# Altium schematic sheet LCL.schdoc
size Letter
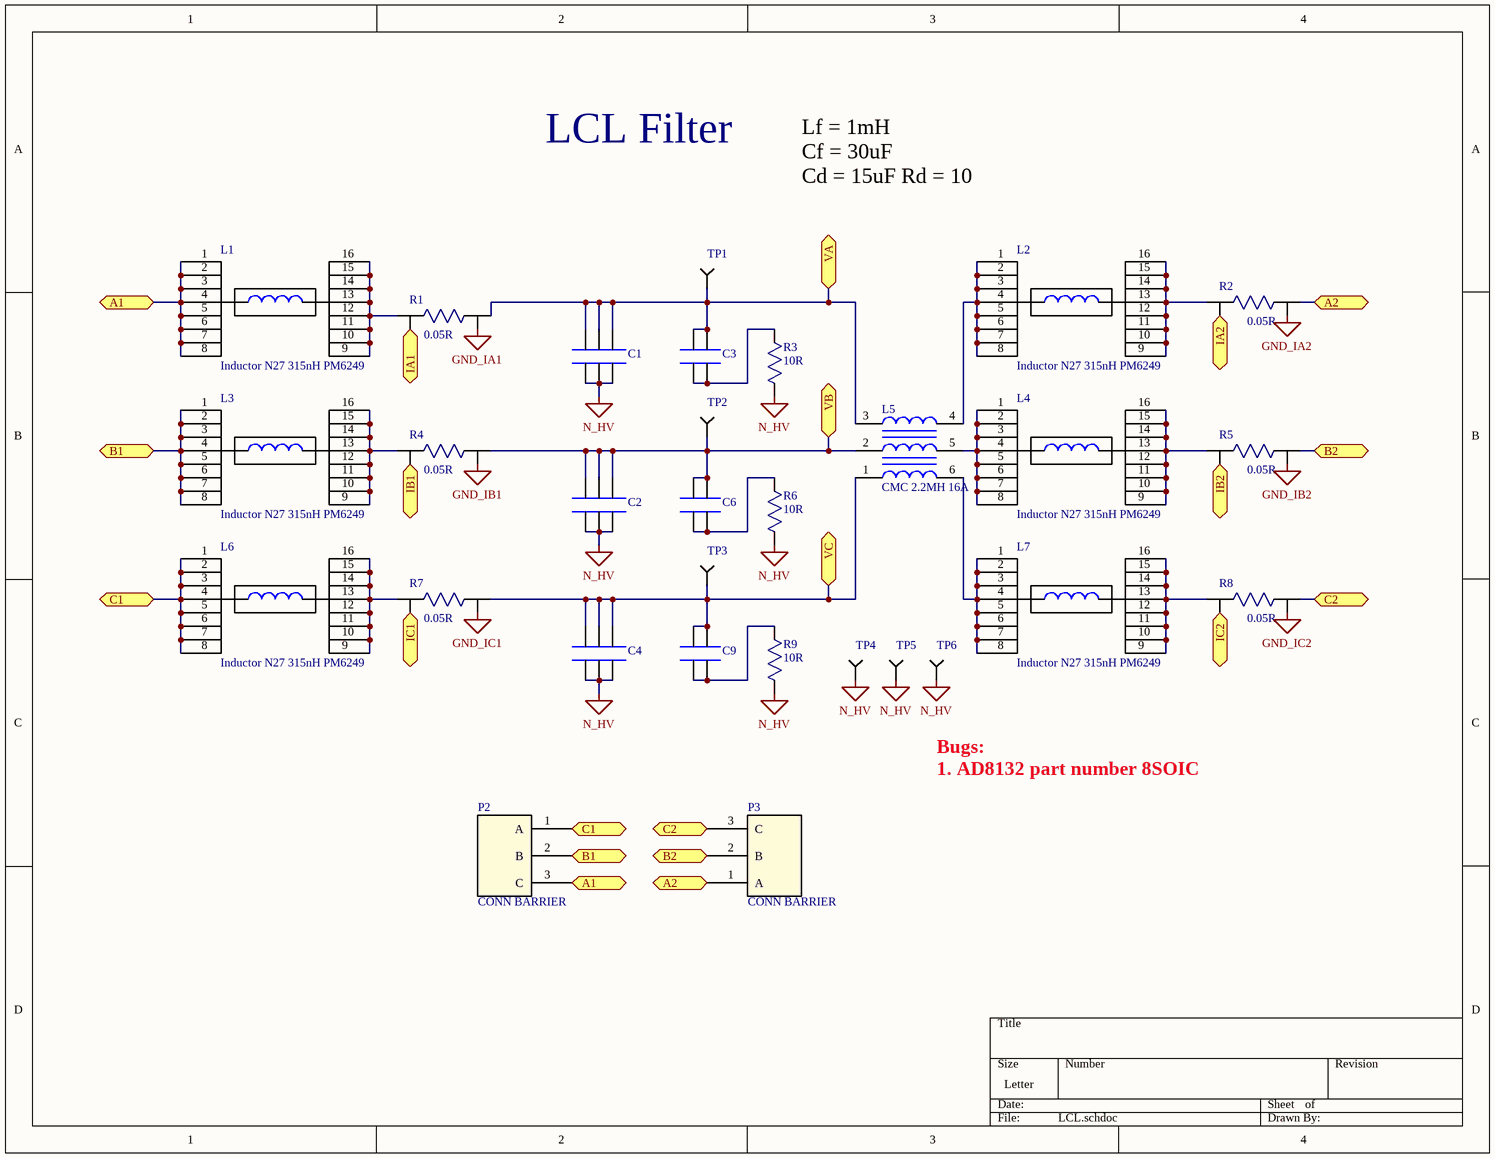
[diagram p0: LCL.schdoc]

## Parts
C1  Cap Film Radial - 4 Leads  [Radial - 4 Leads - 30uF]  (value not drawn)
C2  Cap Film Radial - 4 Leads  [Radial - 4 Leads - 30uF]  (value not drawn)
C3  Cap Film Radial - 4 Leads  [Radial - 4 Leads]  (value not drawn)
C4  Cap Film Radial - 4 Leads  [Radial - 4 Leads - 30uF]  (value not drawn)
C6  Cap Film Radial - 4 Leads  [Radial - 4 Leads]  (value not drawn)
C9  Cap Film Radial - 4 Leads  [Radial - 4 Leads]  (value not drawn)
L1  Inductor N27 315nH PM6249  [IND_PM6249]
L2  Inductor N27 315nH PM6249  [IND_PM6249]
L3  Inductor N27 315nH PM6249  [IND_PM6249]
L4  Inductor N27 315nH PM6249  [IND_PM6249]
L5  CMC 2.2MH 16A  [CM Choke]
L6  Inductor N27 315nH PM6249  [IND_PM6249]
L7  Inductor N27 315nH PM6249  [IND_PM6249]
P2  CONN BARRIER  [Terminal Barrier 3PIN]
P3  CONN BARRIER  [Terminal Barrier 3PIN]
R1  value 0.05R  [Res Precision CSM3637Z]  (hidden comment: Resistor Precision)
R2  value 0.05R  [Res Precision CSM3637Z]  (hidden comment: Resistor Precision)
R3  value 10R  [Axial 50mm]  (hidden comment: Resistor Power)
R4  value 0.05R  [Res Precision CSM3637Z]  (hidden comment: Resistor Precision)
R5  value 0.05R  [Res Precision CSM3637Z]  (hidden comment: Resistor Precision)
R6  value 10R  [Axial 50mm]  (hidden comment: Resistor Power)
R7  value 0.05R  [Res Precision CSM3637Z]  (hidden comment: Resistor Precision)
R8  value 0.05R  [Res Precision CSM3637Z]  (hidden comment: Resistor Precision)
R9  value 10R  [Axial 50mm]  (hidden comment: Resistor Power)
TP1  Test point  [TP_1.6mm]  (value not drawn)
TP2  Test point  [TP_1.6mm]  (value not drawn)
TP3  Test point  [TP_1.6mm]  (value not drawn)
TP4  Test point  [TP_1.6mm]  (value not drawn)
TP5  Test point  [TP_1.6mm]  (value not drawn)
TP6  Test point  [TP_1.6mm]  (value not drawn)

## Ports
A1, A2, B1, B2, C1, C2, IA1, IA2, IB1, IB2, IC1, IC2, VA, VB, VC

## Nets
GND_IA1: R1.2
GND_IA2: R2.2
GND_IB1: R4.2
GND_IB2: R5.2
GND_IC1: R7.2
GND_IC2: R8.2
N_HV: C1.1(OUT) C1.2(OUT) C1.3(OUT) C2.1(OUT) C2.2(OUT) C2.3(OUT) C4.1(OUT) C4.2(OUT) C4.3(OUT) R3.1 R6.1 R9.1 TP4.1(TP) TP5.1(TP) TP6.1(TP)
A1: L1.1 L1.2 L1.3 L1.4 L1.5 L1.6 L1.7 L1.8 P2.3(C) ; port A1
A2: P3.1(A) R2.1 ; port A2
B1: L3.1 L3.2 L3.3 L3.4 L3.5 L3.6 L3.7 L3.8 P2.2(B) ; port B1
B2: P3.2(B) R5.1 ; port B2
C1: L6.1 L6.2 L6.3 L6.4 L6.5 L6.6 L6.7 L6.8 P2.1(A) ; port C1
C2: P3.3(C) R8.1 ; port C2
IA1: R1.3 ; port IA1
IA2: R2.3 ; port IA2
IB1: R4.3 ; port IB1
IB2: R5.3 ; port IB2
IC1: R7.3 ; port IC1
IC2: R8.3 ; port IC2
VA: C1.4(OUT) C1.5(OUT) C1.6(OUT) C3.3(OUT) C3.4(OUT) L5.3 R1.1 TP1.1(TP) ; port VA
VB: C2.4(OUT) C2.5(OUT) C2.6(OUT) C6.3(OUT) C6.4(OUT) L5.2 R4.1 TP2.1(TP) ; port VB
VC: C4.4(OUT) C4.5(OUT) C4.6(OUT) C9.3(OUT) C9.4(OUT) L5.1 R7.1 TP3.1(TP) ; port VC
NetC3_1: C3.1(OUT) C3.2(OUT) R3.2
NetC6_1: C6.1(OUT) C6.2(OUT) R6.2
NetC9_1: C9.1(OUT) C9.2(OUT) R9.2
NetL1_9: L1.9 L1.10 L1.11 L1.12 L1.13 L1.14 L1.15 L1.16 R1.4
NetL2_1: L2.1 L2.2 L2.3 L2.4 L2.5 L2.6 L2.7 L2.8 L5.4
NetL2_9: L2.9 L2.10 L2.11 L2.12 L2.13 L2.14 L2.15 L2.16 R2.4
NetL3_9: L3.9 L3.10 L3.11 L3.12 L3.13 L3.14 L3.15 L3.16 R4.4
NetL4_1: L4.1 L4.2 L4.3 L4.4 L4.5 L4.6 L4.7 L4.8 L5.5
NetL4_9: L4.9 L4.10 L4.11 L4.12 L4.13 L4.14 L4.15 L4.16 R5.4
NetL5_6: L5.6 L7.1 L7.2 L7.3 L7.4 L7.5 L7.6 L7.7 L7.8
NetL6_9: L6.9 L6.10 L6.11 L6.12 L6.13 L6.14 L6.15 L6.16 R7.4
NetL7_9: L7.9 L7.10 L7.11 L7.12 L7.13 L7.14 L7.15 L7.16 R8.4

## Notes on the sheet
- LCL Filter
- Lf = 1mH
  Cf = 30uF
  Cd = 15uF Rd = 10
  Lm = 373uH
- Bugs:
  1. AD8132 part number 8SOIC

## Library data of the parts
C1 C2 C4 = Cap Film Radial - 4 Leads - 30uF: Radial - 4 Leads; Part: BC3122-ND
C3 C6 C9 = Cap Film Radial - 4 Leads: Radial - 4 Leads; Part: BC2763-ND
L5 = CMC 1.5MH 20A: CM Choke 2.2MH 16A 3LN TH; Part: .495-7001-ND
P2 P3 = Terminal Blocks - Barrier Blocks: CONN BARRIER STRIP 3CIRC 0.325"; Part: A98461-ND
R1 R2 R4 R5 R7 R8 = Resistor Precision: RES SMD 0.02 OHM 0.1% 2W 3637; Part: Y1473-.05CCT-ND
R3 R6 R9 = Resistor Power: RES 5.0 OHM 10W 1% WW AXIAL; Part: RSD-5.0RCT-ND
TP1-TP6 = Testpoint